# EAGLE design gdm-multiiface (EAGLE 7.7.0)
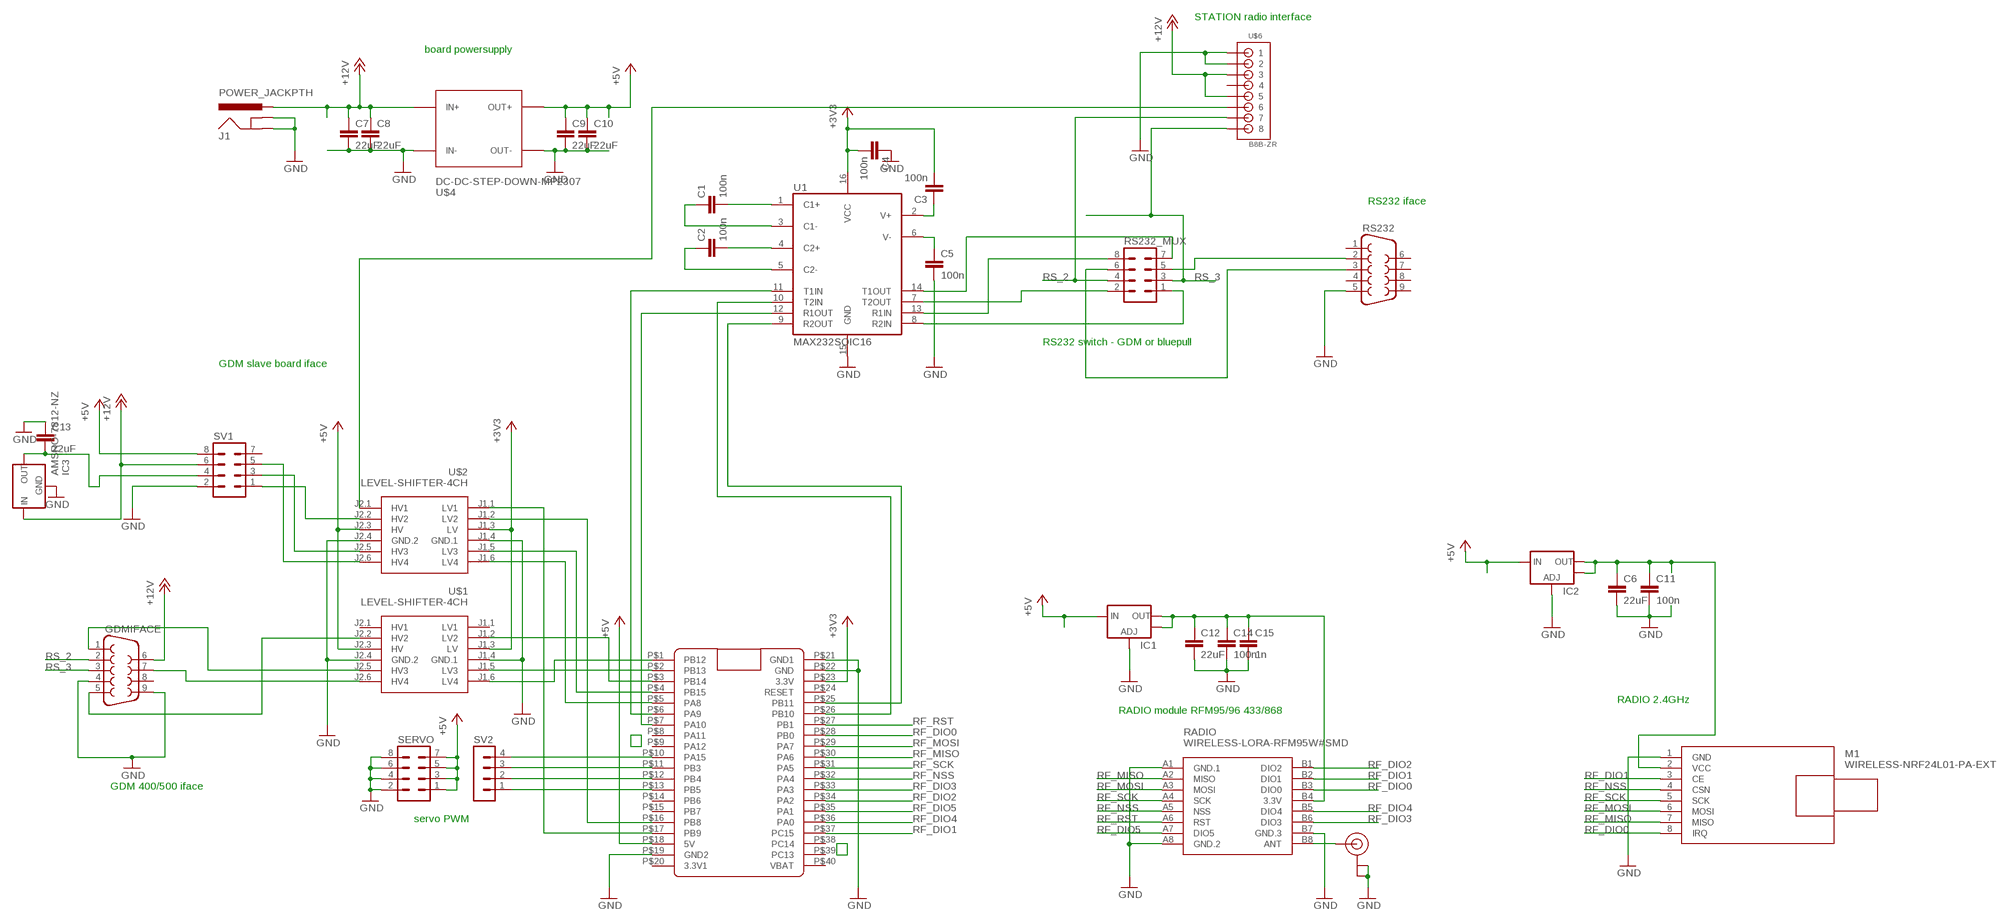
[diagram p0: schematic, sheet 1]

## Parts
BLUEPILL  BLUE_PILL  [BLUE_PILL]
C1  100n  C-EUC0805  [C0805]
C2  100n  C-EUC0805  [C0805]
C3  100n  C-EUC0805  [C0805]
C4  100n  C-EUC0805  [C0805]
C5  100n  C-EUC0805  [C0805]
C6  22uF  C-EUC1210K  [C1210K]
C7  22uF  C-EUC1210K  [C1210K]
C8  22uF  C-EUC1210K  [C1210K]
C9  22uF  C-EUC1210K  [C1210K]
C10  22uF  C-EUC1210K  [C1210K]
C11  100n  C-EUC0805K  [C0805K]
C12  22uF  C-EUC1210K  [C1210K]
C13  22uF  C-EUC1210K  [C1210K]
C14  100n  C-EUC0805K  [C0805K]
C15  1n  C-EUC0805K  [C0805K]
GDMIFACE  DB9FEMALE  [DB9]
IC1  V_REG_LM1117SOT223  [SOT223]
IC2  V_REG_LM1117SOT223  [SOT223]
IC3  AMSRO-7812-NZ  79XXS  [79XXS]
J1  POWER_JACKPTH  [POWER_JACK_PTH]
M1  WIRELESS-NRF24L01-PA-EXT  [WIRELESS-NRF24L01-PA-EXT]
RADIO  WIRELESS-LORA-RFM95W#SMD  [WIRELESS-LORA-RFM95W#SMD]
RS232  DB9FEMALE  [DB9]
RS232_MUX  MA04-2  [MA04-2]
SERVO  MA04-2  [MA04-2]
SV1  MA04-2  [MA04-2]
SV2  MA04-1  [MA04-1]
U1  MAX232SOIC16  [SO016]
U$1  LEVEL-SHIFTER-4CH  [LEVEL-SHIFTER-4CH]
U$2  LEVEL-SHIFTER-4CH  [LEVEL-SHIFTER-4CH]
U$3  U.FL  [U.FL]
U$4  DC-DC-STEP-DOWN-MP2307  [DC-DC-STEP-DOWN-MP2307]
U$6  B8B-ZR  [B8B-ZR]

## Nets
+3V3: BLUEPILL.P$23(3.3V) C3.2 C4.2 U1.16(VCC) U$1.J1.3(LV) U$2.J1.3(LV)
+5V: BLUEPILL.P$18(5V) C9.1 C10.1 IC1.3(IN) IC2.3(IN) SERVO.1 SERVO.3 SERVO.5 SERVO.7 SV1.8 U$1.J2.3(HV) U$2.J2.3(HV) U$4.OUT+
+12V: C7.1 C8.1 GDMIFACE.6 IC3.IN J1.PWR SV1.6 U$4.IN+ U$6.3 U$6.5
-12V: C13.2 IC3.OUT SV1.4
GND: BLUEPILL.P$19(GND2) BLUEPILL.P$21(GND1) BLUEPILL.P$22(GND) C4.1 C5.2 C6.2 C7.2 C8.2 C9.2 C10.2 C11.2 C12.2 C13.1 C14.2 C15.2 GDMIFACE.4 GDMIFACE.9 IC1.1(ADJ) IC2.1(ADJ) IC3.GND J1.GND J1.GNDBREAK M1.1(GND) RADIO.A1(GND.1) RADIO.A8(GND.2) RADIO.B7(GND.3) RS232.5 SERVO.2 SERVO.4 SERVO.6 SERVO.8 SV1.2 U1.15(GND) U$1.J1.4(GND.1) U$1.J2.4(GND.2) U$2.J1.4(GND.1) U$2.J2.4(GND.2) U$3.P$1(GND) U$3.P$2(GND) U$4.IN- U$4.OUT- U$6.1 U$6.2
N$1: RADIO.B8(ANT) U$3.P$3(SIGNAL)
N$2: RS232_MUX.7 U1.14(T1OUT)
N$3: RS232_MUX.8 U1.13(R1IN)
N$4: C6.1 C11.1 IC2.2(OUT) IC2.4(OUT) M1.2(VCC)
N$5: BLUEPILL.P$10(PA15) SV2.4
N$6: C5.1 U1.6(V-)
N$7: C3.1 U1.2(V+)
N$8: BLUEPILL.P$11(PB3) SV2.3
N$9: BLUEPILL.P$6(PA9) U1.11(T1IN)
N$10: BLUEPILL.P$7(PA10) U1.12(R1OUT)
N$11: BLUEPILL.P$12(PB4) SV2.2
N$12: BLUEPILL.P$13(PB5) SV2.1
N$13: C12.1 C14.1 C15.1 IC1.2(OUT) IC1.4(OUT) RADIO.B4(3.3V)
N$14: RS232.2 RS232_MUX.5
N$15: C1.2 U1.1(C1+)
N$16: C1.1 U1.3(C1-)
N$17: C2.2 U1.4(C2+)
N$18: C2.1 U1.5(C2-)
N$19: SV1.1 U$2.J2.2(HV2)
N$20: BLUEPILL.P$17(PB9) U$2.J1.1(LV1)
N$21: BLUEPILL.P$4(PB15) U$2.J1.5(LV3)
N$22: BLUEPILL.P$3(PB14) U$1.J1.2(LV2)
N$23: BLUEPILL.P$2(PB13) U$1.J1.5(LV3)
N$24: BLUEPILL.P$1(PB12) U$1.J1.6(LV4)
N$25: GDMIFACE.7 U$1.J2.6(HV4)
N$26: GDMIFACE.1 U$1.J2.5(HV3)
N$27: GDMIFACE.5 U$1.J2.2(HV2)
N$29: SV1.3 U$2.J2.5(HV3)
N$30: SV1.5 U$2.J2.6(HV4)
N$32: BLUEPILL.P$5(PA8) U$2.J1.6(LV4)
N$34: BLUEPILL.P$26(PB10) U1.10(T2IN)
N$35: BLUEPILL.P$25(PB11) U1.9(R2OUT)
N$36: RS232_MUX.2 U1.7(T2OUT)
N$37: RS232_MUX.1 U1.8(R2IN)
N$38: U$2.J2.1(HV1) U$6.6
N$40: RS232.3 RS232_MUX.6
N$42: BLUEPILL.P$16(PB8) U$2.J1.2(LV2)
RF_DIO0: BLUEPILL.P$28(PB0) M1.8(IRQ) RADIO.B3(DIO0)
RF_DIO1: BLUEPILL.P$37(PC15) M1.3(CE) RADIO.B2(DIO1)
RF_DIO2: BLUEPILL.P$34(PA2) RADIO.B1(DIO2)
RF_DIO3: BLUEPILL.P$33(PA3) RADIO.B6(DIO3)
RF_DIO4: BLUEPILL.P$36(PA0) RADIO.B5(DIO4)
RF_DIO5: BLUEPILL.P$35(PA1) RADIO.A7(DIO5)
RF_MISO: BLUEPILL.P$30(PA6) M1.7(MISO) RADIO.A2(MISO)
RF_MOSI: BLUEPILL.P$29(PA7) M1.6(MOSI) RADIO.A3(MOSI)
RF_NSS: BLUEPILL.P$32(PA4) M1.4(CSN) RADIO.A5(NSS)
RF_RST: BLUEPILL.P$27(PB1) RADIO.A6(RST)
RF_SCK: BLUEPILL.P$31(PA5) M1.5(SCK) RADIO.A4(SCK)
RS_2: GDMIFACE.2 RS232_MUX.4 U$6.7
RS_3: GDMIFACE.3 RS232_MUX.3 U$6.8
Unconnected: BLUEPILL.P$8(PA11) BLUEPILL.P$9(PA12) BLUEPILL.P$14(PB6) BLUEPILL.P$15(PB7) BLUEPILL.P$20(3.3V1) BLUEPILL.P$24(RESET) BLUEPILL.P$38(PC14) BLUEPILL.P$39(PC13) BLUEPILL.P$40(VBAT) GDMIFACE.8 RS232.1 RS232.4 RS232.6 RS232.7 RS232.8 RS232.9 SV1.7 U$1.J1.1(LV1) U$1.J2.1(HV1) U$6.4

## Notes on the sheet
- STATION radio interface
- board powersupply
- RS232 iface
- RS232 switch - GDM or bluepull
- GDM slave board iface
- RADIO 2.4GHz
- RADIO module RFM95/96 433/868
- GDM 400/500 iface
- servo PWM

## Library data of the parts
BLUEPILL = BluePill:BLUE_PILL
C1-C15 = rcl:C-EU: CAPACITOR, European symbol
GDMIFACE RS232 = SparkFun:DB9: DB9 Connector Standard DB9 (D-Sub 9) serial connector. Can be used for CAN bus as well as RS485 and RS232. Footprint production proven. Spark Fun Electronics SKU : PRT-00429
IC1 IC2 = SparkFun:V_REG_LM1117: Voltage Regulator LM1117 Standard adjustable voltage regulator but in SMD form. Spark Fun Electronics SKU : COM-00595
IC3 = v-reg:79XXS: VOLTAGE REGULATOR
J1 = SparkFun:POWER_JACK: Power Jack This is the standard 5.5mm barrel jack for power. The PTH is the most common, proven, reliable, footprint. All others are experimental. The Slot footprint only works if the mill layer is transmitted to the PCB fab house so be warned. Spark Fun Electronics SKU : PRT-00119. Mating wall wart : TOL-00298 (and others)
M1 = diy-modules:WIRELESS-NRF24L01-PA-EXT: 2.4 GHz Wireless Module based on NRF24L01 chip with preamplifier and external antenna Click here to find device on ebay.com <http://www.ebay.com/sch/nrf24l01+pa+lna+sma>
RADIO = diy-modules:WIRELESS-LORA-RFM95W: 868/915 MHz LoRa Radio Transceiver Module based on SX1276 chip Click here to find device on ebay.com <http://www.ebay.com/sch/RFM95W+transceiver>
RS232_MUX SERVO SV1 = con-lstb:MA04-2: PIN HEADER; OC_FARNELL: unknown; OC_NEWARK: unknown
SV2 = con-lstb:MA04-1: PIN HEADER; OC_FARNELL: unknown; OC_NEWARK: unknown
U1 = SparkFun:MAX232: RS232 Transceiver Very common IC. This is generically called 'MAX232', but works with the 3V equivalent MAX3232 generic ICs. Field tested and mother approved. Spark Fun Electronics SKU : COM-00316 (DIP) and COM-00589 (SMD)
U$1 U$2 = diy-modules:LEVEL-SHIFTER-4CH: 4-Channel Bi-Directional Logic Level Converter based on BSS128 transistors Click here to find device on ebay.com <http://www.ebay.com/sch/i2c+logic+converter+module>
U$3 = SparkFun:U.FL
U$4 = diy-modules:DC-DC-STEP-DOWN-MP2307: DC/DC Step-Down Regulator based on MP2307DN chip MP2307 datasheet available here: https://cdn-shop.adafruit.com/datasheets/MP2307_r1.9.pdf Click here to find device on ebay.com <http://www.ebay.com/sch/dc+dc+3a+mini+converter>
U$6 = jst:B8B-ZR

## Board
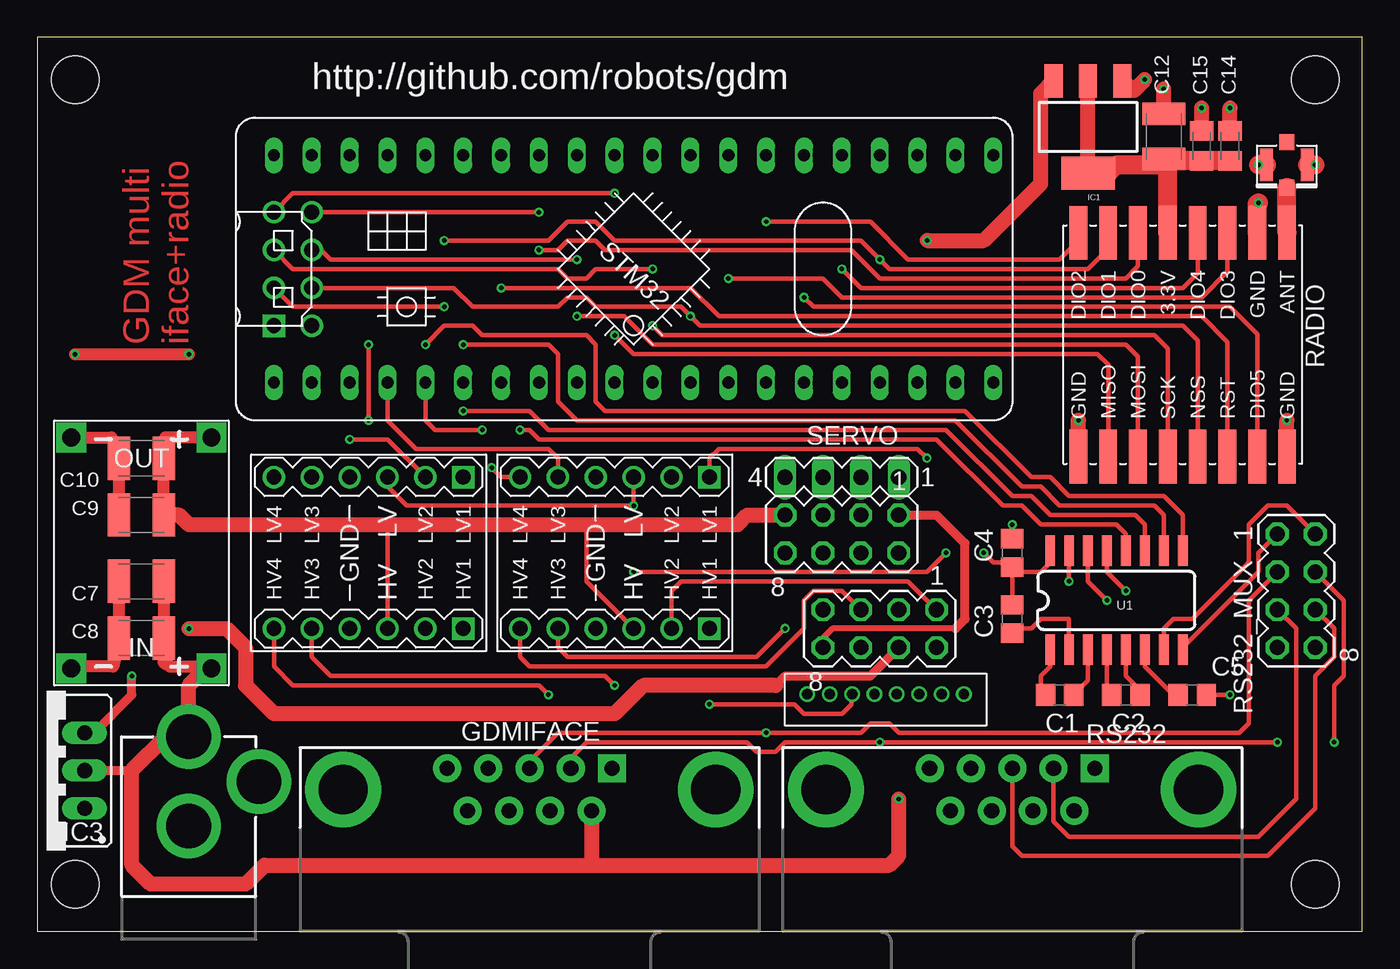
[diagram p1: board, top side]
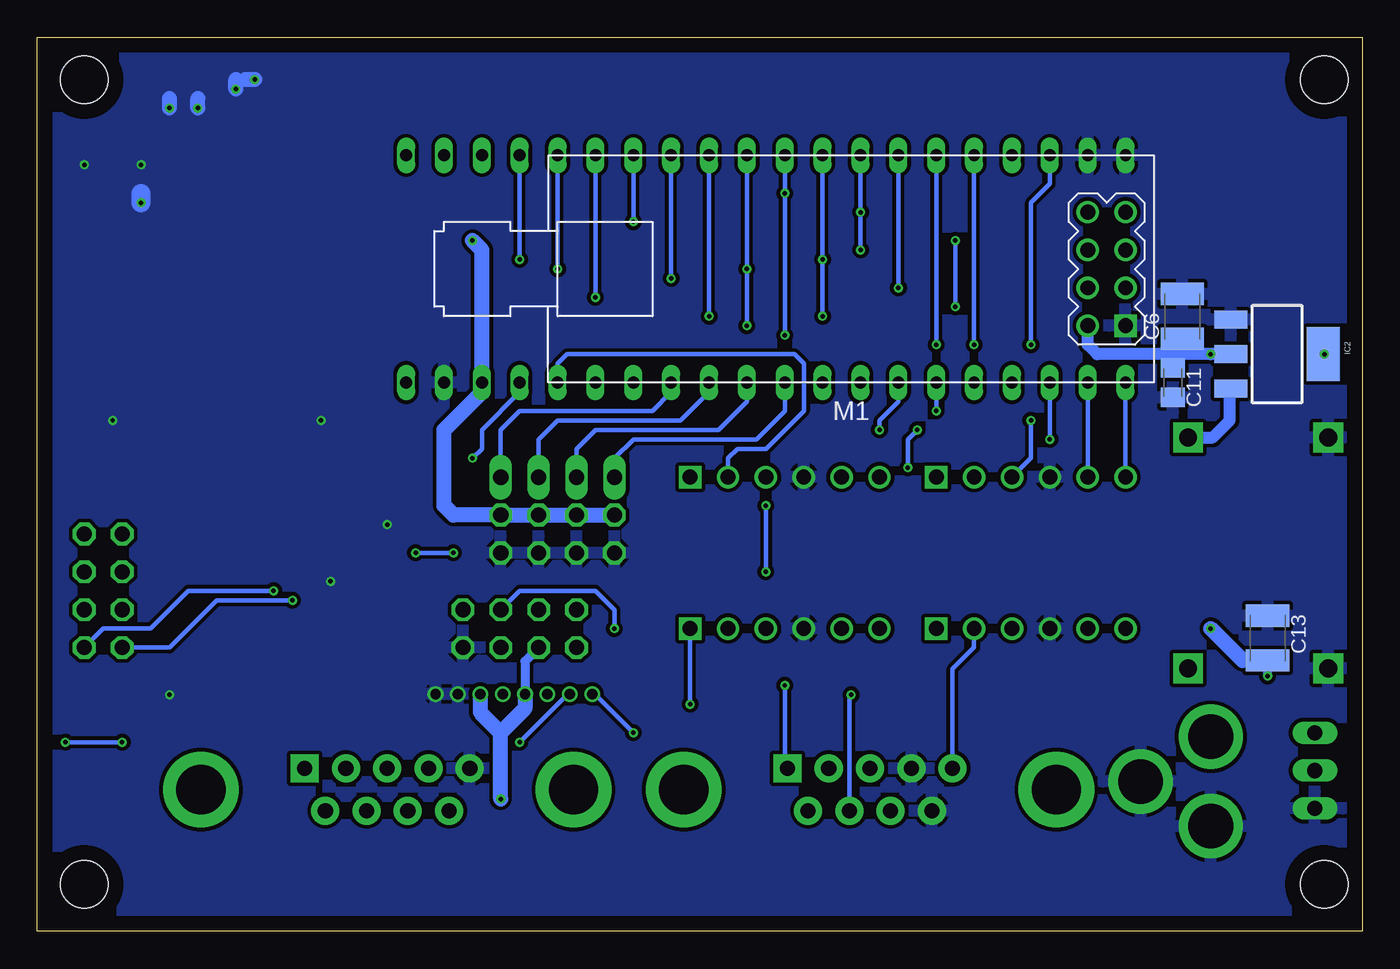
[diagram p2: board, bottom side, seen from below]

Size 88.88 x 59.99 mm. Coordinates in mm from the lower left corner, seen from the top.
Outline: 0,0 88.88,0 88.88,59.99 0,59.99 0,0
Copper layers (1*16): Top 0.035mm / dielectric 1.5mm / Bottom 0.035mm
Design rules "default *": minimum track width 6mil, minimum drill 0.3mm, track to track 10mil, track to pad 10mil, pad to pad 10mil, via to via 10mil, smd to smd 10mil, copper to edge 40mil, drill to drill 8mil, minimum pad ring 6mil, minimum via ring 6mil, stop-mask expansion 4mil, vias tented up to drill 0mil, thermal gap 10mil
Holes 3.2 mm at 85.72,57.15 2.54,57.15 2.54,3.18 85.72,3.18

### Footprints (pad centres in the part's own frame; a part is rotated, then mirrored left to right if it is on the bottom)
BLUE_PILL = drill 0.8 long: P$1 -7.62,15.24; P$2 -7.62,12.7; P$3 -7.62,10.16; P$4 -7.62,7.62; P$5 -7.62,5.08; P$6 -7.62,2.54; P$7 -7.62,0; P$8 -7.62,-2.54; P$9 -7.62,-5.08; P$10 -7.62,-7.62; P$11 -7.62,-10.16; P$12 -7.62,-12.7; P$13 -7.62,-15.24; P$14 -7.62,-17.78; P$15 -7.62,-20.32; P$16 -7.62,-22.86; P$17 -7.62,-25.4; P$18 -7.62,-27.94; P$19 -7.62,-30.48; P$20 -7.62,-33.02; P$21 7.62,15.24; P$22 7.62,12.7; P$23 7.62,10.16; P$24 7.62,7.62; P$25 7.62,5.08; P$26 7.62,2.54; P$27 7.62,0; P$28 7.62,-2.54; P$29 7.62,-5.08; P$30 7.62,-7.62; P$31 7.62,-10.16; P$32 7.62,-12.7; P$33 7.62,-15.24; P$34 7.62,-17.78; P$35 7.62,-20.32; P$36 7.62,-22.86; P$37 7.62,-25.4; P$38 7.62,-27.94; P$39 7.62,-30.48; P$40 7.62,-33.02
C0805 = smd 1.3 x 1.5: 1 -0.95,0; 2 0.95,0
C1210K = smd 1.5 x 2.9: 1 -1.5,0; 2 1.5,0
C0805K = smd 1.3 x 1.6: 1 -1,0; 2 1,0
DB9 = drill 1.016 pad 1.88 square: 1 -5.54,-1.42 | drill 1.016 pad 1.88: 2 -2.77,-1.42; 3 0,-1.42; 4 2.77,-1.42; 5 5.54,-1.42; 6 -4.15,1.42; 7 -1.38,1.42; 8 1.38,1.42; 9 4.15,1.42 | drill 3.302 pad 5.08: G1 -12.5,0; G2 12.5,0
SOT223 = smd 1.219 x 2.235: 1 -2.311,-3.099; 2 0,-3.099; 3 2.311,-3.099 | smd 3.6 x 2.2: 4 0,3.099
79XXS = drill 1.016 long: GND -2.54,-2.54; IN 0,-2.54; OUT 2.54,-2.54
POWER_JACK_PTH = drill 2.997 pad 4.318: GND 0,7.7; GNDBREAK 4.7,10.7; PWR 0,13.7
WIRELESS-NRF24L01-PA-EXT = drill 1 square: 1 -18.415,3.81 | drill 1: 2 -15.875,3.81; 3 -18.415,1.27; 4 -15.875,1.27; 5 -18.415,-1.27; 6 -15.875,-1.27; 7 -18.415,-3.81; 8 -15.875,-3.81
WIRELESS-LORA-RFM95W#SMD = smd 3.6 x 1.2: A1 -7.5,7; A2 -7.5,5; A3 -7.5,3; A4 -7.5,1; A5 -7.5,-1; A6 -7.5,-3; A7 -7.5,-5; A8 -7.5,-7; B1 7.5,7; B2 7.5,5; B3 7.5,3; B4 7.5,1; B5 7.5,-1; B6 7.5,-3; B7 7.5,-5; B8 7.5,-7
MA04-2 = drill 1.016 octagon: 1 -3.81,-1.27; 2 -3.81,1.27; 3 -1.27,-1.27; 4 -1.27,1.27; 5 1.27,-1.27; 6 1.27,1.27; 7 3.81,-1.27; 8 3.81,1.27
MA04-1 = drill 1.016 long: 1 -3.81,0; 2 -1.27,0; 3 1.27,0; 4 3.81,0
SO016 = smd 0.66 x 2.032: 1 -4.445,-3.315; 2 -3.175,-3.315; 3 -1.905,-3.315; 4 -0.635,-3.315; 5 0.635,-3.315; 6 1.905,-3.315; 7 3.175,-3.315; 8 4.445,-3.315; 9 4.445,3.315; 10 3.175,3.315; 11 1.905,3.315; 12 0.635,3.315; 13 -0.635,3.315; 14 -1.905,3.315; 15 -3.175,3.315; 16 -4.445,3.315
LEVEL-SHIFTER-4CH = drill 1 square: J1.1 -5.08,6.35; J2.1 5.08,6.35 | drill 1: J1.2 -5.08,3.81; J1.3 -5.08,1.27; J1.4 -5.08,-1.27; J1.5 -5.08,-3.81; J1.6 -5.08,-6.35; J2.2 5.08,3.81; J2.3 5.08,1.27; J2.4 5.08,-1.27; J2.5 5.08,-3.81; J2.6 5.08,-6.35
U.FL = smd 2.2 x 0.85: P$1 0,1.375; P$2 0,-1.375 | smd 1.05 x 1: P$3 1.525,0; P$4 -1.525,0
DC-DC-STEP-DOWN-MP2307 = drill 1.2 pad 2 square: IN+ -7.747,-4.699; IN- -7.747,4.699; OUT+ 7.747,-4.699; OUT- 7.747,4.699
B8B-ZR = drill 0.7: 1 3.74,0.06; 2 2.24,0.06; 3 0.74,0.06; 4 -0.76,0.06; 5 -2.26,0.06; 6 -3.76,0.06; 7 -5.26,0.06; 8 -6.76,0.06

### Placement (x,y rotation side)
BLUEPILL  31.12,44.45 90 top
C1  68.58,15.87 180 top
C2  73.02,15.87 180 top
C3  65.41,20.96 90 top
C4  65.41,25.4 270 top
C5  77.47,15.87 0 top
C6  12.07,41.27 90 bottom
C7  6.98,23.5 180 top
C8  6.98,19.69 180 top
C9  6.98,27.94 180 top
C10  6.98,31.75 180 top
C11  12.7,36.83 270 bottom
C12  75.56,53.34 90 top
C13  6.35,19.69 270 bottom
C14  80.01,52.7 90 top
C15  78.11,52.7 90 top
GDMIFACE  33.02,9.53 180 top
IC1  70.48,53.97 180 top
IC2  5.71,38.73 270 bottom
IC3  0.63,10.79 90 top
J1  10.16,-0.64 0 top
M1  34.29,44.45 180 bottom
RADIO  76.83,39.37 90 top
RS232  65.41,9.53 180 top
RS232_MUX  84.45,22.86 270 top
SERVO  53.97,26.67 180 top
SV1  56.52,20.32 180 top
SV2  53.97,30.48 180 top
U1  72.39,22.23 0 top
U$1  22.23,25.4 270 top
U$2  38.73,25.4 270 top
U$3  83.82,51.43 270 top
U$4  6.98,25.4 90 top
U$6  58.42,15.87 0 top

### Tracks (layer width: path | path; a pad name or v marks a point on that pad's centre or on a via)
+3V3  (via drill 0.3)
  Top 0.305: C3.2 C4.2 | C4.2 65.41,24.13 67.31,24.13 67.94,24.77 U1.16 | U$1.J1.3 23.5,29.85 24.77,28.57 v40,28.57 U$2.J1.3 | v22.23,39.37 v22.23,34.29 | v40,24.13 59.69,24.13 v60.96,25.4 | v63.5,25.4 64.14,24.77 65.09,24.77 C4.2
  Bottom 0.305: v22.23,34.29 22.23,31.75 U$1.J1.3 | v22.23,39.37 22.23,48.89 20.96,50.16 BLUEPILL.P$23 | v40,28.57 v40,24.13 | v60.96,25.4 v63.5,25.4
+5V  (via drill 0.3)
  Top 0.305: U$1.J2.3 23.5,27.3 | U$2.J2.3 36.83,23.5 36.83,27.3
  Top 0.406: 61.59,20.32 53.34,20.32 52.7,19.69 SV1.8
  Top 0.61: 61.59,20.32 62.23,20.96 62.23,26.04 60.32,27.94 SERVO.1
  Top 0.813: C9.1 8.48,30.48 | 8.48,30.48 C10.1 | U$4.OUT+ 11.43,33.15 8.61,33.15 8.48,30.48
  Top 1.016: 11.81,32.77 11.43,33.15 | v59.69,46.35 63.5,46.35 67.31,50.16 67.31,56.21 IC1.3 | C9.1 9.52,27.94 10.16,27.3 23.5,27.3 36.83,27.3 46.99,27.3 47.62,27.94 SERVO.7
  Bottom 0.813: 8.81,36.02 IC2.3 8.89,36.35 8.89,34.29 10.03,33.15 U$4.OUT+
  Bottom 1.016: v59.69,46.35 59.05,45.72 BLUEPILL.P$18 59.05,36.2 61.59,33.66 61.59,28.57 60.96,27.94 SERVO.1 SERVO.3 SERVO.5 SERVO.7
+12V  (via drill 0.3)
  Top 0.61: IC3.IN 6.35,10.79
  Top 0.813: C7.1 C8.1 8.48,18.19 8.57,18.1 8.89,17.78 11.43,17.78 11.56,17.78 U$4.IN+
  Top 1.016: 8.62,18.05 8.57,18.1 | 11.43,17.78 10.16,16.51 J1.PWR 8.62,13.06 6.35,10.79 6.35,4.45 7.62,3.18 13.97,3.18 15.24,4.45 37.46,4.45 | GDMIFACE.6 37.17,4.74 37.46,4.45 | 37.46,4.45 57.15,4.45 57.78,5.08 v57.78,8.89
  Bottom 0.61: U$6.5 56.16,18.14 SV1.6
  Bottom 1.016: v57.78,8.89 57.78,13.33 | 57.78,13.33 56.16,14.96 U$6.5 | U$6.3 59.16,14.71 57.78,13.33
-12V  (via drill 0.3)
  Top 0.61: IC3.OUT 3.81,13.33 6.35,15.87 v6.35,17.14 | 49.53,16.51 50.16,17.14 55.88,17.14 SV1.4
  Top 1.016: 49.53,16.51 40.64,16.51 38.73,14.6 15.88,14.6 13.97,16.51 13.97,19.05 12.7,20.32 v10.16,20.32
  Bottom 0.61: v6.35,17.14 C13.2
  Bottom 1.016: C13.2 8.02,18.19 v10.16,20.32
GND  (via drill 0.3)
  Top 0.305: C4.1 v65.41,27.3 | U1.15 v69.22,23.5 | C5.2 v80.01,15.87
  Top 0.813: C7.2 C8.2 5.08,17.78 2.41,17.78 U$4.IN- | C9.2 5.48,31.11 | 5.48,31.11 C10.2 | U$4.OUT- 4.98,33.15 5.48,31.11
  Top 1.016: RADIO.A8 83.83,31.13 v83.82,34.29 | RADIO.A1 69.83,34.3 v69.85,34.29 | IC1.1 73.58,56.44 v74.3,57.15 | C12.2 v75.56,56.52 | C15.2 v78.11,55.24 | C14.2 v80.01,55.24
  Top 1.27: U$3.P$1 v85.72,51.43 | U$3.P$2 v81.91,51.43 | RADIO.B7 81.83,48.81 v81.91,48.89
  Bottom 1.016: v74.3,57.15 74.93,57.15 | v75.56,56.52 75.56,57.15 | v78.11,55.24 78.11,55.88 | v80.01,55.24 80.01,55.88
  Bottom 1.27: v81.91,48.89 81.91,49.53
  pour Bottom: -20.32,75.56 89.53,75.56 89.53,-1.27 -20.32,-4.45
N$1
  Top 1.27: RADIO.B8 83.83,49.89 U$3.P$3
N$2  (via drill 0.3)
  Top 0.305: U1.14 70.48,23.5 v71.75,22.23
  Bottom 0.305: v71.75,22.23 76.83,22.23 80.01,19.05 RS232_MUX.7
N$3  (via drill 0.3)
  Top 0.305: U1.13 71.75,24.13 v73.02,22.86
  Bottom 0.305: v73.02,22.86 78.74,22.86 81.28,20.32 84.45,20.32 RS232_MUX.8
N$4  (via drill 0.3)
  Top 0.813: v2.54,38.73 v10.16,38.73
  Bottom 0.813: IC2.2 v10.16,38.73 12.7,38.73 | 12.7,38.73 17.78,38.73 18.41,39.37 M1.2 | C11.1 12.7,38.73 | C6.1 12.07,39.37 12.7,38.73 | IC2.4 v2.54,38.73
N$5
  Bottom 0.305: BLUEPILL.P$10 38.73,34.92 40.64,33.02 48.89,33.02 50.16,31.75 SV2.4
N$6
  Top 0.305: C5.1 76.2,15.87 74.3,17.78 U1.6
N$7
  Top 0.305: U1.2 69.22,20.96 67.31,20.96 66.67,20.32 65.41,20.32 C3.1
N$8
  Bottom 0.305: BLUEPILL.P$11 41.27,35.56 43.18,33.66 51.43,33.66 52.7,32.38 SV2.3
N$9  (via drill 0.3)
  Top 0.305: U1.11 74.3,27.3 73.66,27.94 67.94,27.94 66.67,29.21 65.41,29.21 60.96,33.66 34.29,33.66 33.02,34.92 v28.57,34.92
  Bottom 0.305: v28.57,34.92 BLUEPILL.P$6
N$10  (via drill 0.3)
  Top 0.305: U1.12 73.02,26.67 72.39,27.3 67.31,27.3 66.04,28.57 64.77,28.57 60.32,33.02 33.66,33.02 33.02,33.66 v32.38,33.66
  Bottom 0.305: v32.38,33.66 32.38,34.29 31.12,35.56 BLUEPILL.P$7
N$11
  Bottom 0.305: BLUEPILL.P$12 43.81,36.2 45.72,34.29 53.97,34.29 55.24,33.02 SV2.2
N$12
  Bottom 0.305: BLUEPILL.P$13 46.35,36.2 47.62,34.92 56.52,34.92 57.78,33.66 SV2.1
N$13
  Top 0.813: IC1.2 70.48,57.15
  Top 1.016: IC1.4 70.48,57.15
  Top 1.27: C14.1 C15.1 75.7,51.7 C12.1 | RADIO.B4 75.83,51.57 C12.1 | IC1.4 71.83,50.88 72.39,51.43 75.16,51.43 C12.1
N$14
  Top 0.305: RS232.2 68.17,7.39 69.22,6.35 81.91,6.35 84.45,8.89 84.45,20.32 RS232_MUX.5
N$15
  Top 0.305: U1.1 67.94,17.78 67.31,17.14 67.31,16.19 C1.2
N$16
  Top 0.305: U1.3 70.48,16.83 C1.1
N$17
  Top 0.305: U1.4 71.75,16.19 C2.2
N$18
  Top 0.305: U1.5 73.02,17.14 73.66,16.51 C2.1
N$19
  Top 0.305: SV1.1 58.42,23.5 43.18,23.5 42.54,22.86 U$2.J2.2
N$20  (via drill 0.3)
  Top 0.305: U$2.J1.1 45.08,31.75 45.72,32.38 59.05,32.38 v59.69,31.75
  Bottom 0.305: v59.69,31.75 59.05,32.38 59.05,33.66 56.52,36.2 BLUEPILL.P$17
N$21
  Top 0.305: U$2.J1.5 34.92,31.75 34.29,32.38 25.4,32.38 23.5,34.29 BLUEPILL.P$4
N$22  (via drill 0.3)
  Top 0.305: v20.96,33.02 23.5,33.02 U$1.J1.2
  Bottom 0.305: BLUEPILL.P$3 v20.96,33.02
N$23
  Bottom 0.305: BLUEPILL.P$2 U$1.J1.5
N$24
  Bottom 0.305: BLUEPILL.P$1 U$1.J1.6
N$25  (via drill 0.3)
  Top 0.305: U$1.J2.6 15.88,17.78 17.14,16.51 33.66,16.51 v34.29,15.87
  Bottom 0.305: GDMIFACE.7 34.4,15.76 v34.29,15.87
N$26  (via drill 0.3)
  Top 0.305: U$1.J2.5 18.41,18.42 19.69,17.14 38.1,17.14 v38.73,16.51
  Bottom 0.305: v38.73,16.51 38.73,11.12 GDMIFACE.1
N$27
  Bottom 0.305: GDMIFACE.5 27.48,17.61 26.04,19.05 U$1.J2.2
N$29  (via drill 0.3)
  Top 0.305: U$2.J2.5 34.92,19.05 35.56,18.42 48.26,18.42 v50.16,20.32
  Bottom 0.305: v50.16,20.32 50.16,21.59 51.43,22.86 56.52,22.86 SV1.3
N$30
  Top 0.305: U$2.J2.6 32.38,18.42 33.02,17.78 48.89,17.78 51.43,20.32 51.43,22.23 52.07,22.86 53.97,22.86 SV1.5
N$32  (via drill 0.3)
  Top 0.305: U$2.J1.6 31.12,30.48 v30.48,31.11 | v29.85,33.66 26.67,33.66 26.04,34.29 BLUEPILL.P$5
  Bottom 0.305: v30.48,31.11 30.48,33.02 v29.85,33.66
N$34  (via drill 0.3)
  Top 0.305: 75.56,25.4 U1.10 75.56,27.94 74.93,28.57 68.58,28.57 67.31,29.85 66.04,29.85 61.59,34.29 36.2,34.29 34.92,35.56 34.92,38.73 34.29,39.37 v28.57,39.37
  Bottom 0.305: v28.57,39.37 BLUEPILL.P$26
N$35  (via drill 0.3)
  Top 0.305: U1.9 76.83,27.94 75.56,29.21 69.22,29.21 67.94,30.48 66.67,30.48 62.23,34.92 38.1,34.92 37.46,35.56 37.46,39.37 36.83,40 29.85,40 29.21,40.64 27.3,40.64 v26.04,39.37
  Bottom 0.305: v26.04,39.37 BLUEPILL.P$25
N$36
  Top 0.305: U1.7 75.56,20.32 76.2,20.96 77.47,20.96 81.28,24.77 81.28,27.3 82.55,28.57 83.82,28.57 RS232_MUX.2
N$37
  Top 0.305: RS232_MUX.1 81.91,25.4 81.91,24.13 76.83,19.05 76.97,19.05 U1.8
N$38  (via drill 0.3)
  Top 0.305: v45.08,15.24 50.8,15.24 51.43,14.6 53.97,14.6 54.61,15.24 U$6.6
  Bottom 0.305: v45.08,15.24 U$2.J2.1
N$40
  Top 0.305: RS232_MUX.6 86.99,20.32 86.99,18.42 85.72,17.14 85.72,8.25 82.55,5.08 66.04,5.08 65.41,5.71 RS232.3
N$42
  Bottom 0.305: BLUEPILL.P$16 53.97,38.1 53.34,38.73 38.1,38.73 37.46,38.1 37.46,34.92 40,32.38 41.91,32.38 42.54,31.75 U$2.J1.2
RF_DIO0  (via drill 0.3)
  Top 0.305: RADIO.B3 73.83,44.62 73.02,43.81 56.52,43.81 54.61,45.72 38.1,45.72 37.46,46.35 35.56,46.35 34.92,45.72 v33.66,45.72 | M1.8 v33.66,48.26
  Bottom 0.305: BLUEPILL.P$28 v33.66,48.26 v33.66,45.72
RF_DIO1  (via drill 0.3)
  Top 0.305: RADIO.B2 71.83,45.8 70.48,44.45 57.15,44.45 v56.52,45.09 55.24,46.35 38.73,46.35 37.46,47.62 35.56,47.62 34.29,46.35 v27.3,46.35 | v27.3,41.91 17.14,41.91 M1.3
  Bottom 0.305: v56.52,45.09 BLUEPILL.P$37 | v27.3,46.35 v27.3,41.91
RF_DIO2  (via drill 0.3)
  Top 0.305: RADIO.B1 69.83,46.34 68.58,45.09 58.42,45.09 55.88,47.62 v48.89,47.62
  Bottom 0.305: v48.89,47.62 BLUEPILL.P$34
RF_DIO3  (via drill 0.3)
  Top 0.305: RADIO.B6 79.83,44.27 78.11,42.54 53.97,42.54 52.7,43.81 v46.35,43.81
  Bottom 0.305: v46.35,43.81 BLUEPILL.P$33
RF_DIO4  (via drill 0.3)
  Top 0.305: RADIO.B5 77.83,44.18 76.83,43.18 55.24,43.18 v53.97,44.45
  Bottom 0.305: v53.97,44.45 BLUEPILL.P$36
RF_DIO5  (via drill 0.3)
  Top 0.305: RADIO.A7 81.83,40.09 80.01,41.91 52.07,41.91 v51.43,42.54
  Bottom 0.305: v51.43,42.54 BLUEPILL.P$35
RF_MISO  (via drill 0.3)
  Top 0.305: RADIO.A2 71.83,38.02 71.12,38.73 40,38.73 v38.73,40 | M1.7 17.14,49.53 v38.73,49.53
  Bottom 0.305: BLUEPILL.P$30 v38.73,49.53 v38.73,40
RF_MOSI  (via drill 0.3)
  Top 0.305: RADIO.A3 73.83,38.56 73.02,39.37 41.27,39.37 39.37,41.27 v36.2,41.27 | M1.6 19.05,45.72 19.69,45.09 v36.2,45.09
  Bottom 0.305: BLUEPILL.P$29 v36.2,45.09 v36.2,41.27
RF_NSS  (via drill 0.3)
  Top 0.305: RADIO.A5 77.83,39.64 76.83,40.64 44.45,40.64 v43.81,41.27 43.18,41.91 37.46,41.91 36.83,42.54 35.56,42.54 34.92,41.91 29.21,41.91 27.94,43.18 M1.4
  Bottom 0.305: v43.81,41.27 BLUEPILL.P$32
RF_RST  (via drill 0.3)
  Top 0.305: RADIO.A6 79.83,39.54 78.11,41.27 45.72,41.27 43.81,43.18 v31.12,43.18
  Bottom 0.305: v31.12,43.18 BLUEPILL.P$27
RF_SCK  (via drill 0.3)
  Top 0.305: RADIO.A4 75.83,39.1 74.93,40 41.91,40 v41.27,40.64 | M1.5 17.14,44.45 34.92,44.45 35.56,43.81 36.83,43.81 37.46,44.45 v41.27,44.45
  Bottom 0.305: BLUEPILL.P$31 v41.27,44.45 v41.27,40.64
RS_2  (via drill 0.3)
  Top 0.305: GDMIFACE.2 35.79,11.66 36.83,12.7 47.62,12.7 48.26,12.06 49.53,12.06 50.16,12.7 v56.52,12.7 v83.19,12.7 | v86.99,12.7 86.99,16.51 87.63,17.14 87.63,22.23 RS232_MUX.4
  Bottom 0.305: v83.19,12.7 v86.99,12.7 | U$6.7 53.16,16.05 v56.52,12.7
RS_3  (via drill 0.3)
  Top 0.305: GDMIFACE.3 33.02,11.43 34.92,13.33 v48.89,13.33 55.24,13.33 55.88,13.97 57.15,13.97 57.78,13.33 80.64,13.33 81.28,13.97 81.28,22.23 RS232_MUX.3
  Bottom 0.305: U$6.8 51.66,16.1 v48.89,13.33

### Text on the board
Top: GDM multi / iface+radio
tPlace: http://github.com/robots/gdm